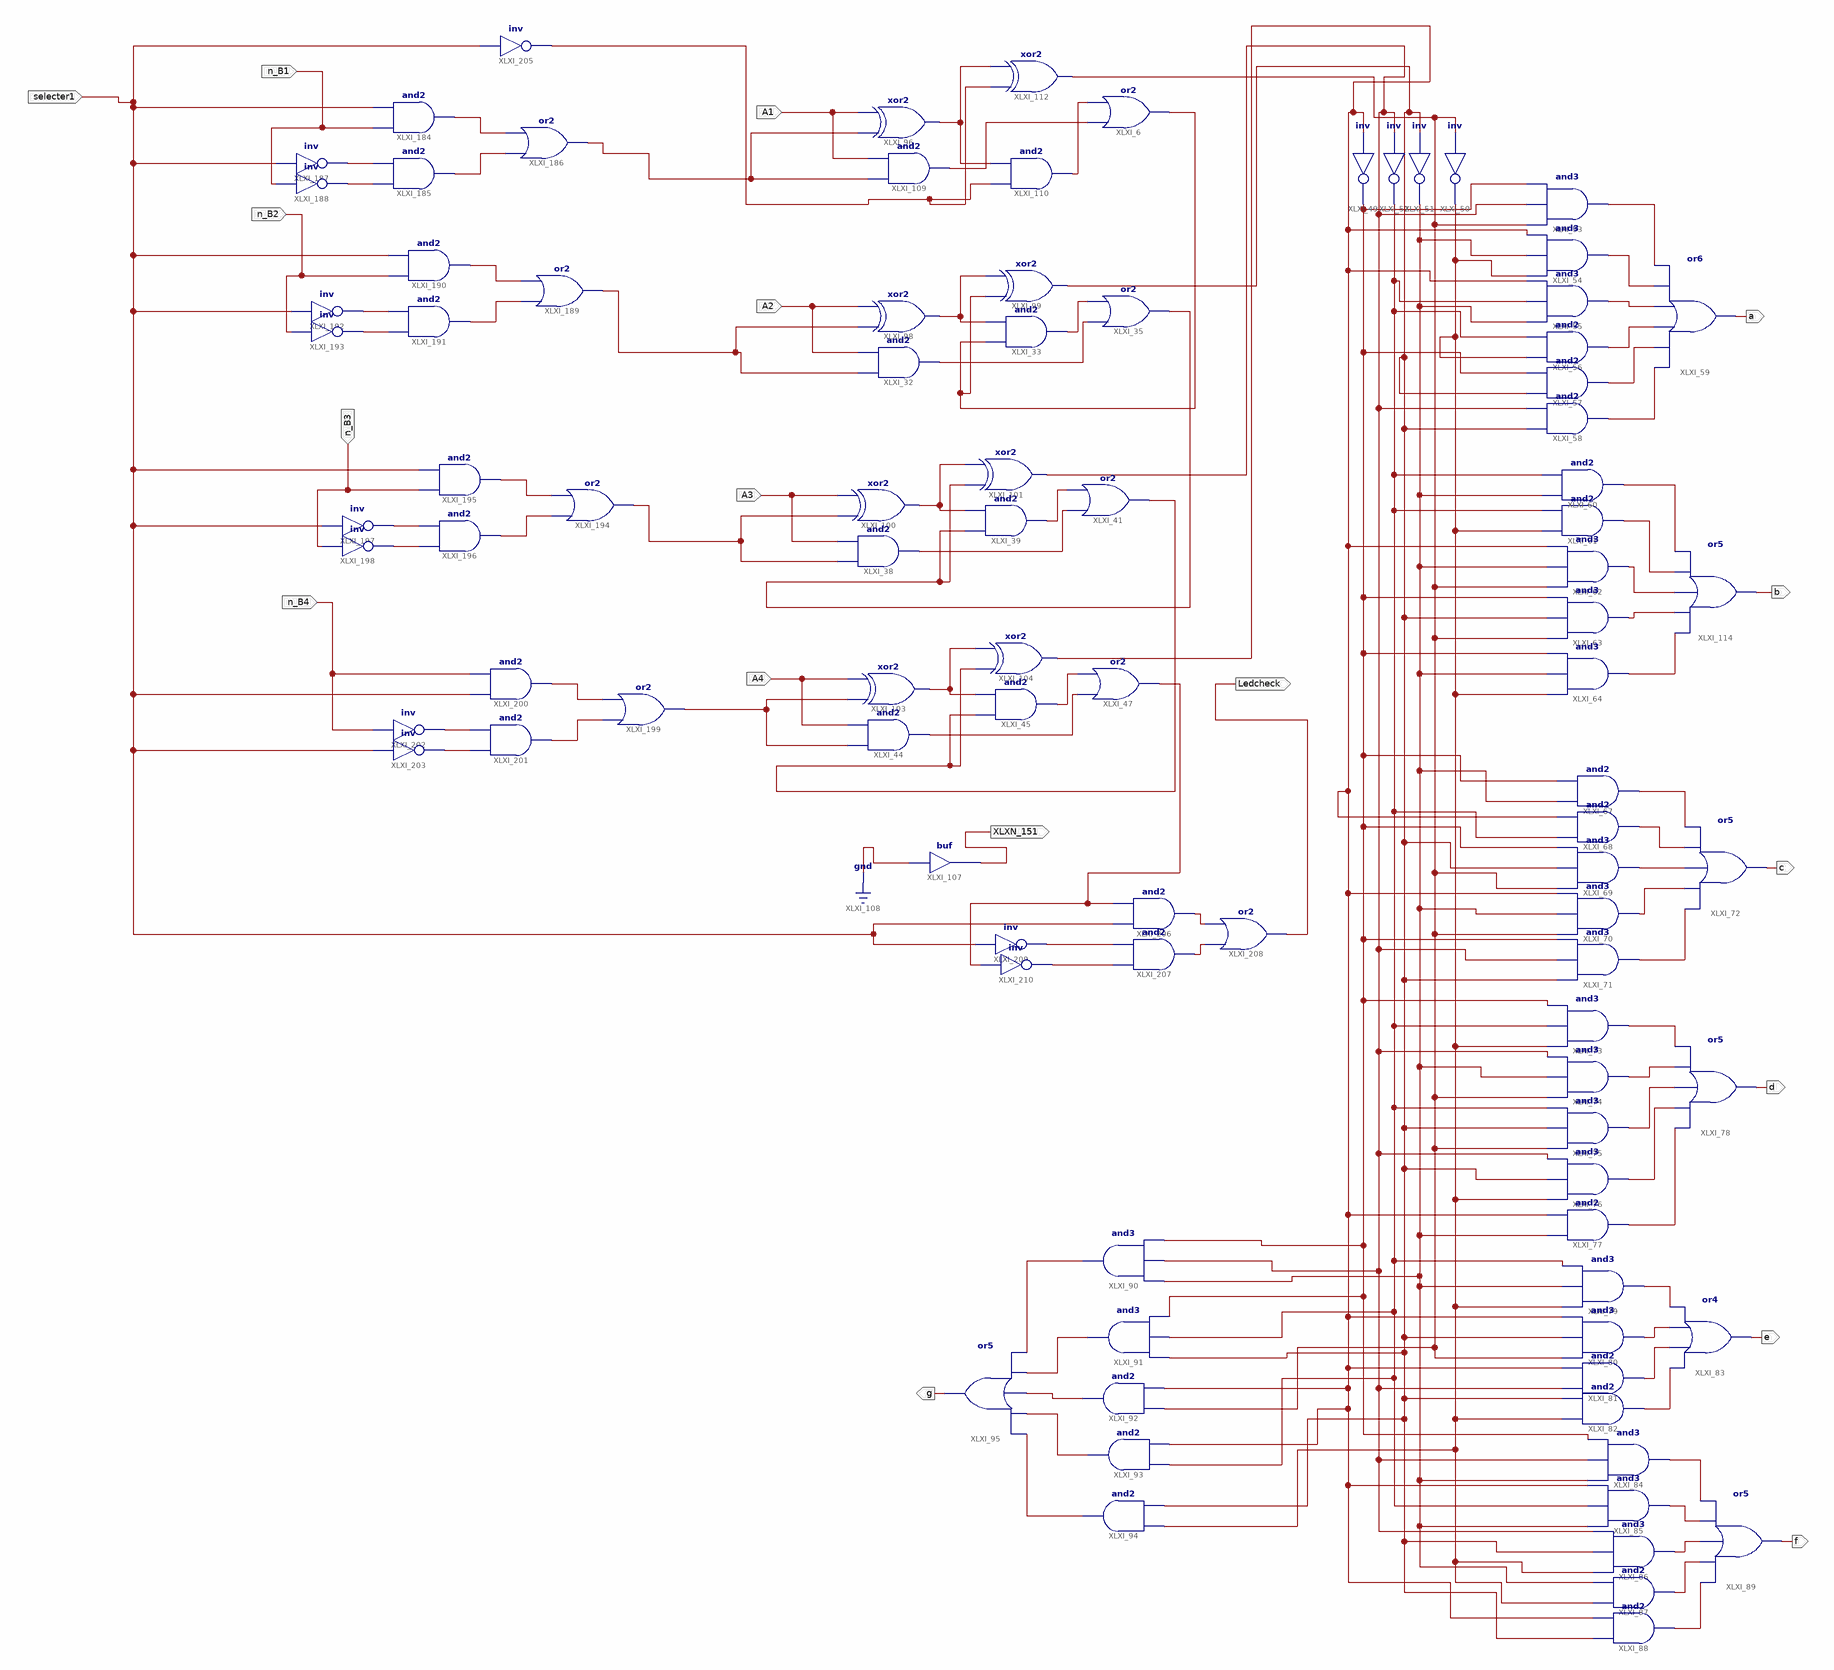
[diagram p0: schematic sheet 1]
// Xilinx ISE schematic Lab6.sch (spartan6) as structural Verilog: 93 symbols, 18 ports
module Lab6 (
  input  A2,
  input  A3,
  input  A4,
  input  A1,
  input  n_B1,
  input  n_B2,
  input  n_B3,
  input  n_B4,
  input  selecter1,
  output a,
  output b,
  output c,
  output d,
  output e,
  output f,
  output g,
  output XLXN_151,
  output Ledcheck
);

  wire B1, B2, B3, selecter, XLXN_44, XLXN_45, XLXN_46, XLXN_47, XLXN_52, XLXN_53, XLXN_54, XLXN_55, XLXN_60,
       XLXN_61, XLXN_62, XLXN_63, XLXN_79, XLXN_80, XLXN_81, XLXN_82, XLXN_83, XLXN_84, XLXN_88, XLXN_89,
       XLXN_90, XLXN_91, XLXN_92, XLXN_95, XLXN_96, XLXN_97, XLXN_98, XLXN_99, XLXN_105, XLXN_106, XLXN_107,
       XLXN_108, XLXN_109, XLXN_111, XLXN_112, XLXN_113, XLXN_114, XLXN_117, XLXN_118, XLXN_119, XLXN_120,
       XLXN_121, XLXN_124, XLXN_125, XLXN_126, XLXN_127, XLXN_128, XLXN_130, XLXN_131, XLXN_132, XLXN_139,
       XLXN_147, XLXN_154, XLXN_155, XLXN_157, XLXN_158, XLXN_160, XLXN_165, XLXN_285, XLXN_286, XLXN_287,
       XLXN_288, XLXN_290, XLXN_291, XLXN_292, XLXN_293, XLXN_295, XLXN_296, XLXN_297, XLXN_298, XLXN_300,
       XLXN_301, XLXN_302, XLXN_303, XLXN_327, XLXN_354, XLXN_355, XLXN_356, XLXN_357, XLXN_367;

  and XLXI_32 (XLXN_46, B2, A2);
  and XLXI_33 (XLXN_47, XLXN_45, XLXN_44);
  or XLXI_35 (XLXN_53, XLXN_46, XLXN_47);
  and XLXI_38 (XLXN_54, B3, A3);
  and XLXI_39 (XLXN_55, XLXN_53, XLXN_52);
  or XLXI_41 (XLXN_61, XLXN_54, XLXN_55);
  and XLXI_44 (XLXN_62, XLXN_327, A4);
  and XLXI_45 (XLXN_63, XLXN_61, XLXN_60);
  or XLXI_47 (XLXN_367, XLXN_62, XLXN_63);
  not XLXI_49 (XLXN_130, XLXN_160);
  not XLXI_52 (XLXN_147, XLXN_165);
  not XLXI_51 (XLXN_132, XLXN_131);
  not XLXI_50 (XLXN_139, XLXN_154);
  and XLXI_53 (XLXN_79, XLXN_154, XLXN_165, XLXN_130);
  and XLXI_54 (XLXN_80, XLXN_139, XLXN_132, XLXN_160);
  and XLXI_55 (XLXN_81, XLXN_132, XLXN_147, XLXN_160);
  and XLXI_56 (XLXN_82, XLXN_139, XLXN_147);
  and XLXI_57 (XLXN_83, XLXN_131, XLXN_130);
  and XLXI_58 (XLXN_84, XLXN_131, XLXN_165);
  or XLXI_59 (a, XLXN_84, XLXN_83, XLXN_82, XLXN_81, XLXN_80, XLXN_79);
  and XLXI_61 (XLXN_89, XLXN_139, XLXN_147);
  and XLXI_62 (XLXN_90, XLXN_154, XLXN_132, XLXN_160);
  and XLXI_63 (XLXN_91, XLXN_154, XLXN_131, XLXN_130);
  and XLXI_64 (XLXN_92, XLXN_139, XLXN_132, XLXN_130);
  and XLXI_67 (XLXN_95, XLXN_132, XLXN_130);
  and XLXI_68 (XLXN_96, XLXN_147, XLXN_160);
  and XLXI_69 (XLXN_97, XLXN_154, XLXN_131, XLXN_130);
  and XLXI_70 (XLXN_98, XLXN_154, XLXN_132, XLXN_160);
  and XLXI_71 (XLXN_99, XLXN_131, XLXN_165, XLXN_130);
  or XLXI_72 (c, XLXN_99, XLXN_98, XLXN_97, XLXN_96, XLXN_95);
  and XLXI_73 (XLXN_105, XLXN_139, XLXN_147, XLXN_130);
  and XLXI_74 (XLXN_106, XLXN_154, XLXN_132, XLXN_165);
  and XLXI_75 (XLXN_107, XLXN_154, XLXN_131, XLXN_147);
  and XLXI_76 (XLXN_108, XLXN_139, XLXN_131, XLXN_165);
  and XLXI_77 (XLXN_109, XLXN_132, XLXN_160);
  or XLXI_78 (d, XLXN_109, XLXN_108, XLXN_107, XLXN_106, XLXN_105);
  and XLXI_79 (XLXN_111, XLXN_139, XLXN_132, XLXN_147);
  and XLXI_80 (XLXN_112, XLXN_154, XLXN_131, XLXN_160);
  and XLXI_81 (XLXN_113, XLXN_165, XLXN_160);
  and XLXI_82 (XLXN_114, XLXN_139, XLXN_131);
  or XLXI_83 (e, XLXN_114, XLXN_113, XLXN_112, XLXN_111);
  and XLXI_84 (XLXN_117, XLXN_132, XLXN_165, XLXN_130);
  and XLXI_85 (XLXN_118, XLXN_132, XLXN_147, XLXN_160);
  and XLXI_86 (XLXN_119, XLXN_139, XLXN_131, XLXN_165);
  and XLXI_87 (XLXN_120, XLXN_139, XLXN_132);
  and XLXI_88 (XLXN_121, XLXN_131, XLXN_160);
  or XLXI_89 (f, XLXN_121, XLXN_120, XLXN_119, XLXN_118, XLXN_117);
  and XLXI_90 (XLXN_124, XLXN_130, XLXN_165, XLXN_132);
  and XLXI_91 (XLXN_125, XLXN_130, XLXN_147, XLXN_131);
  and XLXI_92 (XLXN_126, XLXN_160, XLXN_154);
  and XLXI_93 (XLXN_127, XLXN_160, XLXN_147);
  and XLXI_94 (XLXN_128, XLXN_131, XLXN_139);
  or XLXI_95 (g, XLXN_124, XLXN_125, XLXN_126, XLXN_127, XLXN_128);
  xor XLXI_96 (XLXN_155, B1, A1);
  xor XLXI_98 (XLXN_44, B2, A2);
  xor XLXI_99 (XLXN_131, XLXN_45, XLXN_44);
  xor XLXI_100 (XLXN_52, B3, A3);
  xor XLXI_101 (XLXN_165, XLXN_53, XLXN_52);
  xor XLXI_103 (XLXN_60, XLXN_327, A4);
  xor XLXI_104 (XLXN_160, XLXN_61, XLXN_60);
  buf XLXI_107 (XLXN_151, 1'b0);
  and XLXI_110 (XLXN_158, selecter, XLXN_155);
  and XLXI_109 (XLXN_157, B1, A1);
  xor XLXI_112 (XLXN_154, selecter, XLXN_155);
  or XLXI_6 (XLXN_45, XLXN_157, XLXN_158);
  or XLXI_114 (b, XLXN_92, XLXN_91, XLXN_90, XLXN_89, XLXN_88);
  and XLXI_60 (XLXN_88, XLXN_132, XLXN_147);
  and XLXI_184 (XLXN_288, n_B1, selecter1);
  and XLXI_185 (XLXN_287, XLXN_286, XLXN_285);
  or XLXI_186 (B1, XLXN_287, XLXN_288);
  not XLXI_187 (XLXN_285, selecter1);
  not XLXI_188 (XLXN_286, n_B1);
  or XLXI_189 (B2, XLXN_292, XLXN_293);
  and XLXI_190 (XLXN_293, n_B2, selecter1);
  and XLXI_191 (XLXN_292, XLXN_291, XLXN_290);
  not XLXI_192 (XLXN_290, selecter1);
  not XLXI_193 (XLXN_291, n_B2);
  or XLXI_194 (B3, XLXN_297, XLXN_298);
  and XLXI_195 (XLXN_298, n_B3, selecter1);
  and XLXI_196 (XLXN_297, XLXN_296, XLXN_295);
  not XLXI_197 (XLXN_295, selecter1);
  not XLXI_198 (XLXN_296, n_B3);
  or XLXI_199 (XLXN_327, XLXN_302, XLXN_303);
  and XLXI_200 (XLXN_303, selecter1, n_B4);
  and XLXI_201 (XLXN_302, XLXN_301, XLXN_300);
  not XLXI_202 (XLXN_300, n_B4);
  not XLXI_203 (XLXN_301, selecter1);
  not XLXI_205 (selecter, selecter1);
  and XLXI_206 (XLXN_354, selecter1, XLXN_367);
  and XLXI_207 (XLXN_355, XLXN_357, XLXN_356);
  or XLXI_208 (Ledcheck, XLXN_355, XLXN_354);
  not XLXI_209 (XLXN_356, selecter1);
  not XLXI_210 (XLXN_357, XLXN_367);
endmodule
